# Altium schematic sheet [07] SERIAL-USB.SchDoc
size A4; SheetNumber: 7
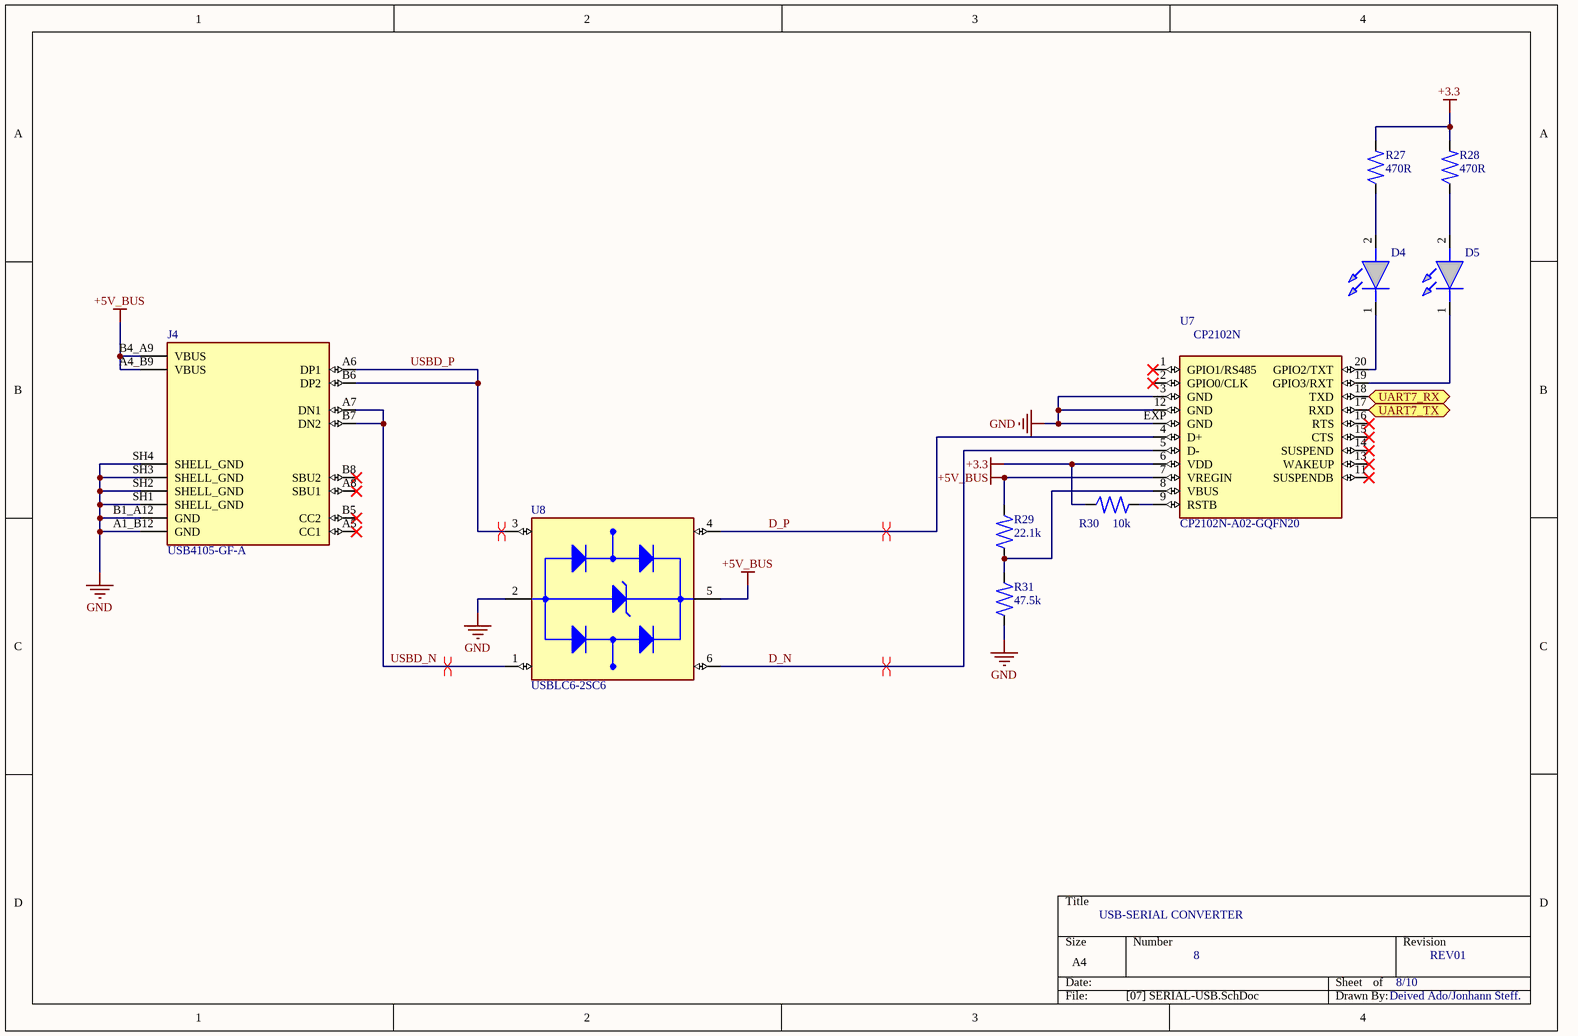
[diagram p0: [07] SERIAL-USB.SchDoc]

## Parts
D4  LED GREEN SMD  [LED 0805]  (value not drawn)
D5  LED GREEN SMD  [LED 0805]  (value not drawn)
J4  USB4105-GF-A  [GCT_USB4105-GF-A]
R27  470R  [RES_0603]
R28  470R  [RES_0603]
R29  22.1k  [RES_0603]
R30  10k  [RES_0603]
R31  47.5k  [RES_0603]
U7  CP2102N-A02-GQFN20  [WFQFN-20]
U8  USBLC6-2SC6  [SOT95P280X145-6N]

## Ports
UART7_RX (out), UART7_TX (in)

## Nets
+3.3: R27.1 R28.1 R30.2 U7.6(VDD)
+5V_BUS: J4.A4_B9(VBUS) J4.B4_A9(VBUS) R29.2 U7.7(VREGIN) U8.5(VBUS)
GND: J4.A1_B12(GND) J4.B1_A12(GND) J4.SH1(SHELL_GND) J4.SH2(SHELL_GND) J4.SH3(SHELL_GND) J4.SH4(SHELL_GND) R31.1 U7.3(GND) U7.12(GND) U7.EXP(GND) U8.2(GND)
D_N: U7.5(D-) U8.6(I/O1_OUT)
D_P: U7.4(D+) U8.4(I/O2_OUT)
UART7_RX: U7.18(TXD) ; port UART7_RX
UART7_TX: U7.17(RXD) ; port UART7_TX
USBD_N: J4.A7(DN1) J4.B7(DN2) U8.1(I/O1_IN)
USBD_P: J4.A6(DP1) J4.B6(DP2) U8.3(I/O2_IN)
NetD4_1: D4.1(K) U7.20(GPIO2/TXT)
NetD4_2: D4.2(A) R27.2
NetD5_1: D5.1(K) U7.19(GPIO3/RXT)
NetD5_2: D5.2(A) R28.2
NetR29_1: R29.1 R31.2 U7.8(VBUS)
NetR30_1: R30.1 U7.9(RSTB)

Not connected (* = marked no-connect by the designer): J4 A5(CC1)* A8(SBU1)* B5(CC2)* B8(SBU2)*; U7 1(GPIO1/RS485)* 2(GPIO0/CLK)* 11(SUSPENDB)* 13(WAKEUP)* 14(SUSPEND)* 15(CTS)* 16(RTS)*

## Layout directives
differential pair: D_N, D_P, USBD_N, USBD_P

## Notes on the sheet
- USB-SERIAL CONVERTER
- 8
- 8/10
- REV01
- Deived Ado/Jonhann Steff.
- (in symbol CP2102N-A02-GQFN20) CP2102N

## Library data of the parts
D4 D5 = LED GREEN SMD: LED Green 0805 Rectangular; Mfr. Part #: 15008GS75000; Manufacturer: Wurth Elektronik; Purchase-URL: https://br.mouser.com/ProductDetail/Wurth-Elektronik/150080GS75000?qs=2kOmHSv6VfQRoTEZVk1mGA%3D%3D; Datasheet: https://www.we-online.com/components/products/datasheet/150080GS75000.pdf; Price: 0,19
J4 = USB4105-GF-A: USB-C (USB TYPE-C) USB 2.0 Receptacle Connector 24 (16+8 Dummy) Position Surface Mount, Right Angle; Through Hole; MF: GCT; SnapEDA_Link: https://www.snapeda.com/parts/USB4105-GF-A/Global+Connector+Technology/view-part/?ref=snap; Package: None; Value: *; MP: USB4105-GF-A; Check_prices: https://www.snapeda.com/parts/USB4105-GF-A/Global+Connector+Technology/view-part/?ref=eda
R27-R31 = R_Small: Generic Resistor symbol
U7 = CP2102N-A02-GQFN20: USB Bridge, USB to UART USB 2.0 UART Interface 20-QFN (3x3); MF: Silicon Labs; Availability: In Stock; Price: None; Purchase-URL: https://pricing.snapeda.com/search/part/CP2102N-A02-GQFN20/?ref=eda; Package: WFQFN-20 Silicon Labs; SnapEDA_Link: https://www.snapeda.com/parts/CP2102N-A02-GQFN20/Silicon+Labs/view-part/?ref=snap; MP: CP2102N-A02-GQFN20; Value: *; Check_prices: https://www.snapeda.com/parts/CP2102N-A02-GQFN20/Silicon+Labs/view-part/?ref=eda
U8 = USBLC6-2SC6: 17V Clamp 5A (8/20Âµs) Ipp Tvs Diode Surface Mount SOT-23-6; MF: STMicroelectronics; Value: *; SnapEDA_Link: https://www.snapeda.com/parts/USBLC6-2SC6/STMicroelectronics/view-part/?ref=snap; Check_prices: https://www.snapeda.com/parts/USBLC6-2SC6/STMicroelectronics/view-part/?ref=eda; Purchase-URL: https://pricing.snapeda.com/search/part/USBLC6-2SC6/?ref=eda; Price: None; Availability: In Stock; Package: SOT-23-6 STMicroelectronics; MP: USBLC6-2SC6